# EAGLE schematic robot_power_board (EAGLE 9.0.0)
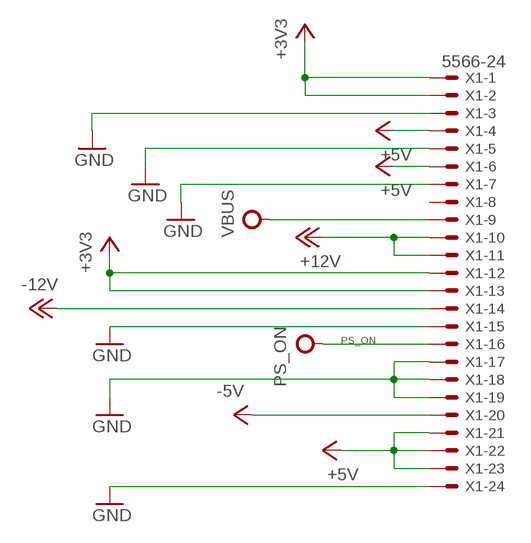
[diagram p0: schematic, sheet 1]

## Parts
X1  5566-24  [5566-24]

## Nets
+3V3: X1.1 X1.2 X1.12 X1.13
+5V: X1.4 X1.6 X1.21 X1.22 X1.23
+12V: X1.10 X1.11
-5V: X1.20
-12V: X1.14
GND: X1.3 X1.5 X1.7 X1.15 X1.17 X1.18 X1.19 X1.24
PS_ON: X1.16
VBUS: X1.9
Unconnected: X1.8

## Library data of the parts
X1 = con-molex:5566-24: Mini FIT connector 24 pol Source: http://www.molex.com; MF: MOLEX; OC_FARNELL: unknown; OC_NEWARK: unknown